# Altium schematic sheet CC0402JRNPO9BN180.schdoc
size 127 x 101 mm
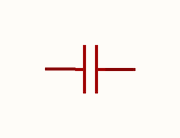
[diagram p0: CC0402JRNPO9BN180.schdoc]

## Parts
C?  cc0402jrnpo9bn180  [C0402]  (value not drawn)

## Nets

Not connected (* = marked no-connect by the designer): C? 1 2

## Library data of the parts
C? = cc0402jrnpo9bn180: 容值:18pF;精度:±5%;额定电压:50V;温度系数:NP0;; Manufacturer: YAGEO(国巨); AddInBom: yes; ModelId: 36a51122f27c49738f86b3bfa98863e0; ModelName: C0402_L1.0-W0.5-H0.5; ModelTransform: 39.37,19.685,0,0,0,0,0,0,0; Value: 18pF; Tolerance: ±5%; Voltage Rating: 50V; Temperature Coefficient: NP0; Symbol: CC0402JRNPO9BN180; LCSC Part Name: 18pF ±5% 50V; SupplierPart: C106202; ManufacturerPart: CC0402JRNPO9BN180; Supplier Footprint: 0402; JLCPCB Part Class: Extended Part; Datasheet: https://item.szlcsc.com/datasheet/CC0402JRNPO9BN180/107417.html; Supplier: LCSC; ConvertToPcb: yes; FootprintName: C0402